# Altium schematic sheet adc_dac_txmix.SchDoc: mcHF Pro Transceiver UI board
size A3; Author: Krassi Atanassov; CompanyName: MØNKA; Engineer: For radio amateurs experimentation, non-commercial use only. Thank you!; Revision: 0.8.2; SheetTotal: 18
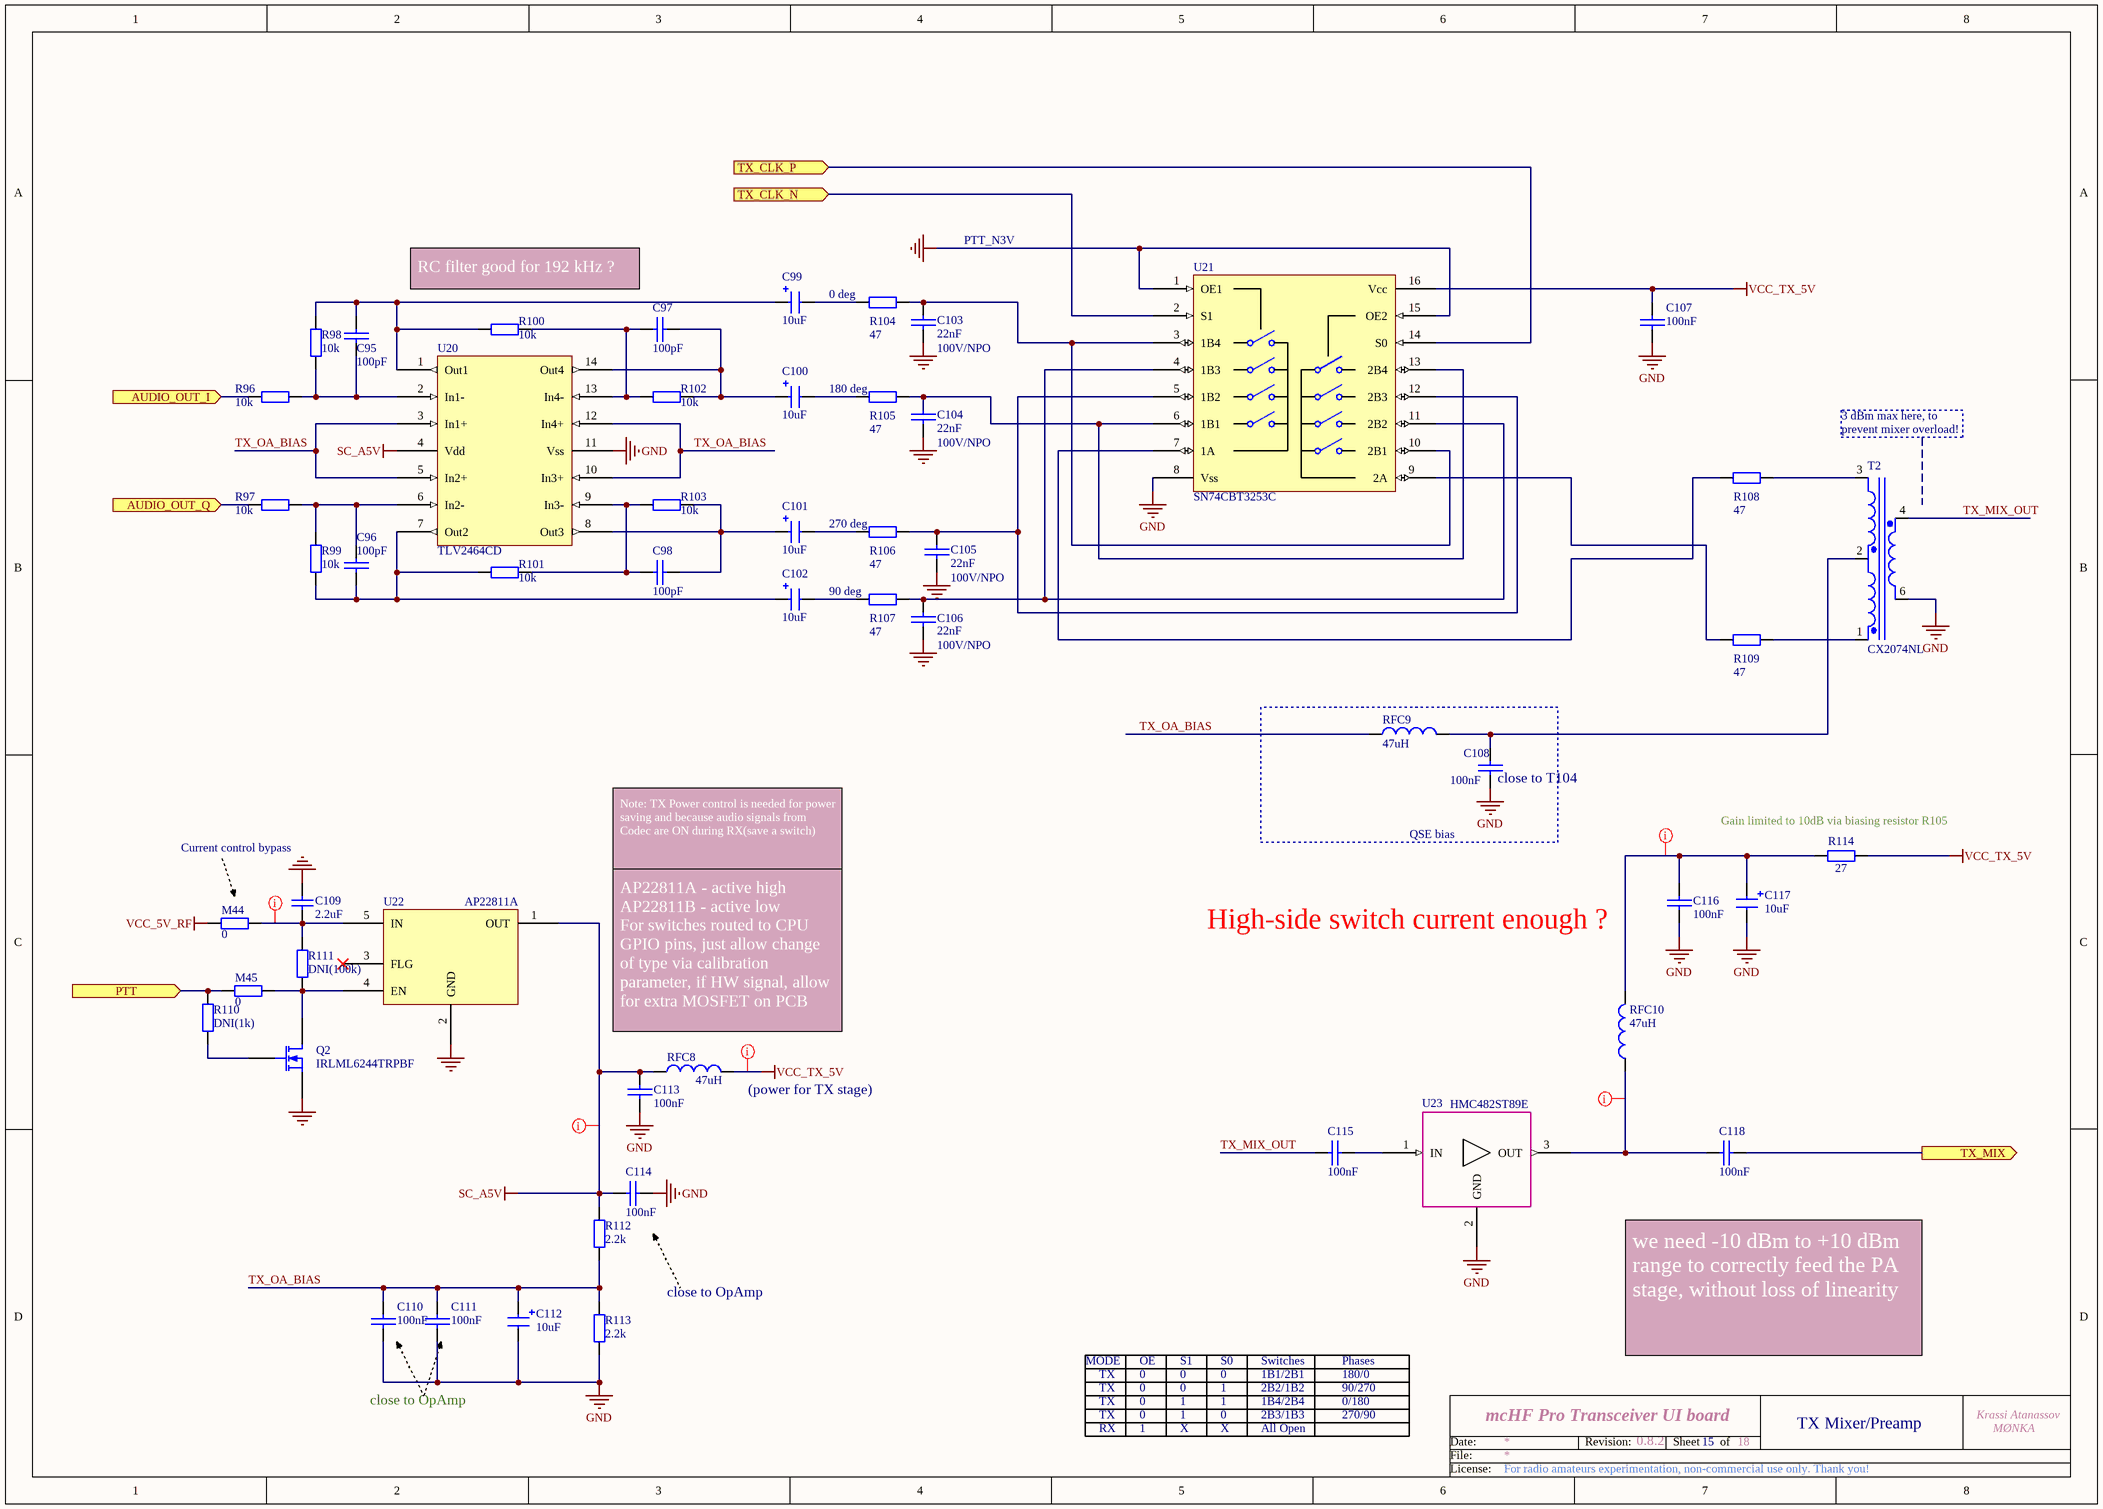
[diagram p0: adc_dac_txmix.SchDoc]

## Parts
C95  100pF  [0805]
C96  100pF  [0805]
C97  100pF  [0805]
C98  100pF  [0805]
C99  10uF  [1206_Elec_Cap]
C100  10uF  [1206_Elec_Cap]
C101  10uF  [1206_Elec_Cap]
C102  10uF  [1206_Elec_Cap]
C103  22nF  Voltage: 100V/NPO  [CAP_B]
C104  22nF  Voltage: 100V/NPO  [CAP_B]
C105  22nF  Voltage: 100V/NPO  [CAP_B]
C106  22nF  Voltage: 100V/NPO  [CAP_B]
C107  100nF  [0805]
C108  100nF  [0805]
C109  2.2uF  [0805]
C110  100nF  [0805]
C111  100nF  [0805]
C112  10uF  [1206_Elec_Cap]
C113  100nF  [0805]
C114  100nF  [0805]
C115  100nF  [0805]
C116  100nF  [0805]
C117  10uF  [1206_Elec_Cap]
C118  100nF  [0805]
M44  0  [0805]
M45  0  [0805]
Q2  IRLML6244TRPBF  [SOT-23]  (no BOM)
R96  10k  [0805]
R97  10k  [0805]
R98  10k  [0805]
R99  10k  [0805]
R100  10k  [0805]
R101  10k  [0805]
R102  10k  [0805]
R103  10k  [0805]
R104  47  [0805]
R105  47  [0805]
R106  47  [0805]
R107  47  [0805]
R108  47  [0805]
R109  47  [0805]
R110  DNI(1k)  [0805]  (no BOM)
R111  DNI(100k)  [0805]  (no BOM)
R112  2.2k  [0805]
R113  2.2k  [0805]
R114  27  [1206]
RFC8  47uH  [0805]
RFC9  47uH  [0805]
RFC10  47uH  [0805]
T2  CX2074NL  [SOP5_NEW1]
U20  TLV2464CD  [SO-14-Pro]
U21  SN74CBT3253C  [SO-16-Pro]
U22  AP22811A  [SOT25-5]
U23  HMC482ST89E  [SOT89L_new]

## Blocks framed on the sheet
close to T104: C108 RFC9

## Ports
AUDIO_OUT_I (in), AUDIO_OUT_Q (in), PTT (in), TX_CLK_N (in), TX_CLK_P (in), TX_MIX (out)

## Nets
GND: C103.2 C104.2 C105.2 C106.2 C107.1 C108.1 C109.1 C110.1 C111.1 C112.2 C113.1 C114.1 C116.2 C117.2 Q2.2(S) R113.1 T2.6(Pri+) U20.11(Vss) U21.1(OE1) U21.8(Vss) U21.15(OE2) U22.2(GND) U23.2(GND)
SC_A5V: C113.2 C114.2 R112.2 RFC8.1 U20.4(Vdd) U22.1(OUT)
VCC_5V_RF: M44.1
VCC_TX_5V: C107.2 R114.1 RFC8.2 U21.16(Vcc)
AUDIO_OUT_I: R96.1 ; port AUDIO_OUT_I
AUDIO_OUT_Q: R97.1 ; port AUDIO_OUT_Q
PTT: M45.2 R110.2 ; port PTT
TX_CLK_N: U21.2(S1) ; port TX_CLK_N
TX_CLK_P: U21.14(S0) ; port TX_CLK_P
TX_MIX: C118.1 ; port TX_MIX
TX_MIX_OUT: C115.2 T2.4(Pri-)
TX_OA_BIAS: C110.2 C111.2 C112.1 R112.1 R113.2 RFC9.1 U20.3(In1+) U20.5(In2+) U20.10(In3+) U20.12(In4+)
NetC95_1: C95.1 R96.2 R98.1 U20.2(In1-)
NetC95_2: C95.2 C99.1 R98.2 R100.1 U20.1(Out1)
NetC96_1: C96.1 C102.1 R99.1 R101.1 U20.7(Out2)
NetC96_2: C96.2 R97.2 R99.2 U20.6(In2-)
NetC97_1: C97.1 C100.1 R102.2 U20.14(Out4)
NetC97_2: C97.2 R100.2 R102.1 U20.13(In4-)
NetC98_1: C98.1 C101.1 R103.2 U20.8(Out3)
NetC98_2: C98.2 R101.2 R103.1 U20.9(In3-)
NetC99_2: C99.2 R104.1
NetC100_2: C100.2 R105.1
NetC101_2: C101.2 R106.1
NetC102_2: C102.2 R107.1
NetC103_1: C103.1 R104.2 U21.3(1B4) U21.10(2B1)
NetC104_1: C104.1 R105.2 U21.6(1B1) U21.13(2B4)
NetC105_1: C105.1 R106.2 U21.5(1B2) U21.12(2B3)
NetC106_1: C106.1 R107.2 U21.4(1B3) U21.11(2B2)
NetC108_2: C108.2 RFC9.2 T2.2(SecCmn)
NetC109_2: C109.2 M44.2 R111.1 U22.5(IN)
NetC115_1: C115.1 U23.1(IN)
NetC116_1: C116.1 C117.1 R114.2 RFC10.2
NetC118_2: C118.2 RFC10.1 U23.3(OUT)
NetM45_1: M45.1 Q2.3(D) R111.2 U22.4(EN)
NetQ2_1: Q2.1(G) R110.1
NetR108_1: R108.1 U21.7(1A)
NetR108_2: R108.2 T2.3(Sec180)
NetR109_1: R109.1 U21.9(2A)
NetR109_2: R109.2 T2.1(Sec0)

Not connected (* = marked no-connect by the designer): U22 3(FLG)*

## Layout directives
rule Width Constraint [Pref Width = 12mil    Min Width = 12mil    Max Width = 12mil]: NetC109_2, NetC116_1, NetC118_2, SC_A5V, VCC_TX_5V

## Notes on the sheet
- PTT_N3V
- RC filter good for 192 kHz ?
- (near R104) 0 deg
- (near R105) 180 deg
- 3 dBm max here, to
- (near T2) prevent mixer overload!
- (near R106) 270 deg
- (near R107) 90 deg
- (near C109) Current control bypass
- QSE bias
- (near R114) Gain limited to 10dB via biasing resistor R105
- Note: TX Power control is needed for power saving and because audio signals from Codec are ON during RX(save a switch)
- (near C116) High-side switch current enough ?
- AP22811A - active high                                 AP22811B - active low                             For switches routed to CPU GPIO pins, just allow change of type via calibration parameter, if HW signal, allow for extra MOSFET on PCB
- (near RFC8) (power for TX stage)
- close to OpAmp
- MODE
- TX
- 0
- OE
- S1
- S0
- 1
- Switches
- 1B1/2B1
- 2B2/1B2
- Phases
- 180/0
- 90/270
- we need -10 dBm to +10 dBm range to correctly feed the PA stage, without loss of linearity
- RX
- X
- 2B3/1B3
- 1B4/2B4
- All Open
- 270/90
- 0/180
- 15
- TX Mixer/Preamp
- Date:
- File:
- Revision:
- Sheet
- of
- License:

## Library data of the parts
C95-C98 = CAP: Capacitor; Order: FN 233-2692; QT Order: QCC-00070; Price: 0.056
C99-C102 C112 C117 = CAP-POL: Electrolitic capacitor; Order: FN 233-3009; QT Order: QCC-00166; Price: 0.204
C103-C106 = CAP: Capacitor; Order: FN 221-1120; Price: 0.84
C107 C108 C110 C111 C113-C116 C118 = CAP: Capacitor; Order: FN 252-2090; QT Order: QCC-00154; Price: 0.068
C109 = CAP SMD 0603  X5R 1礔 25V 10%: 0603  X5R 1礔; Rated voltage: 25V; Tolerance: 10%; Manufacturer: *; Manufacturer P/N: *; Order code Farnell: 1288202RL; Value: 1礔; Power: *; Technology: X5R; Temperature  Factor: *; Temperature Max: +125癈; Temperature Min: -55癈; STS Code: *
M44 M45 R110 = RES: Resistor; Order: FN 933-3681; QT Order: QCR-00268; Price: 0.009
Q2 = MOSFET-N: N-Channel MOSFET; QT Order: QCT-00022; QT Price: 0.28; Order: FN 186-4517; Price: 0.231
R96-R103 = RES: Resistor; Order: FN 146-9856; QT Order: QCR-00349; Price: 0.021
R104-R109 = RES: Resistor; Order: FN 173-8942; QT Order: QCR-00293; Price: 0.052
R111 = RES: Resistor; Order: FN 157-6459; QT Order: QCR-00579; Price: 0.061
R112 R113 = RES: Resistor; Order: FN 188-7289; QT Order: QCR-00333; Price: 0.046
R114 = RES: Resistor; Order: FN 205-7802; QT Order: QCR-00427; Price: 0.017
RFC8-RFC10 = TDK-NLV25T: INDUCTOR, SIGNAL LINE, 4.7UH, 1005; Order: FN 166-9895; Price: 0.166
T2 = CX2074NL: Wideband RF Transformer 1:4; Order: DK 553-1655-ND; Price: 2.01
U20 = TLV2464CD: Low Power, Rail-To-Rail OpAmp; Order: FN 845-5171; Price: 1.47
U21 = SN74CBT3253C: Dual 4:1 Demux/Analog Switch; Order: FN 175-0447; Price: 0.69
U22 = AP22811: High-side switch; Order: FN 274-8550
U23 = HMS482ST89E: MMIC AMPLIFIER; Order: FN 245-6527; Notes: What was the Farnell replacement part for this ? Or source from Ali, as it is EOL; Price: 2.82